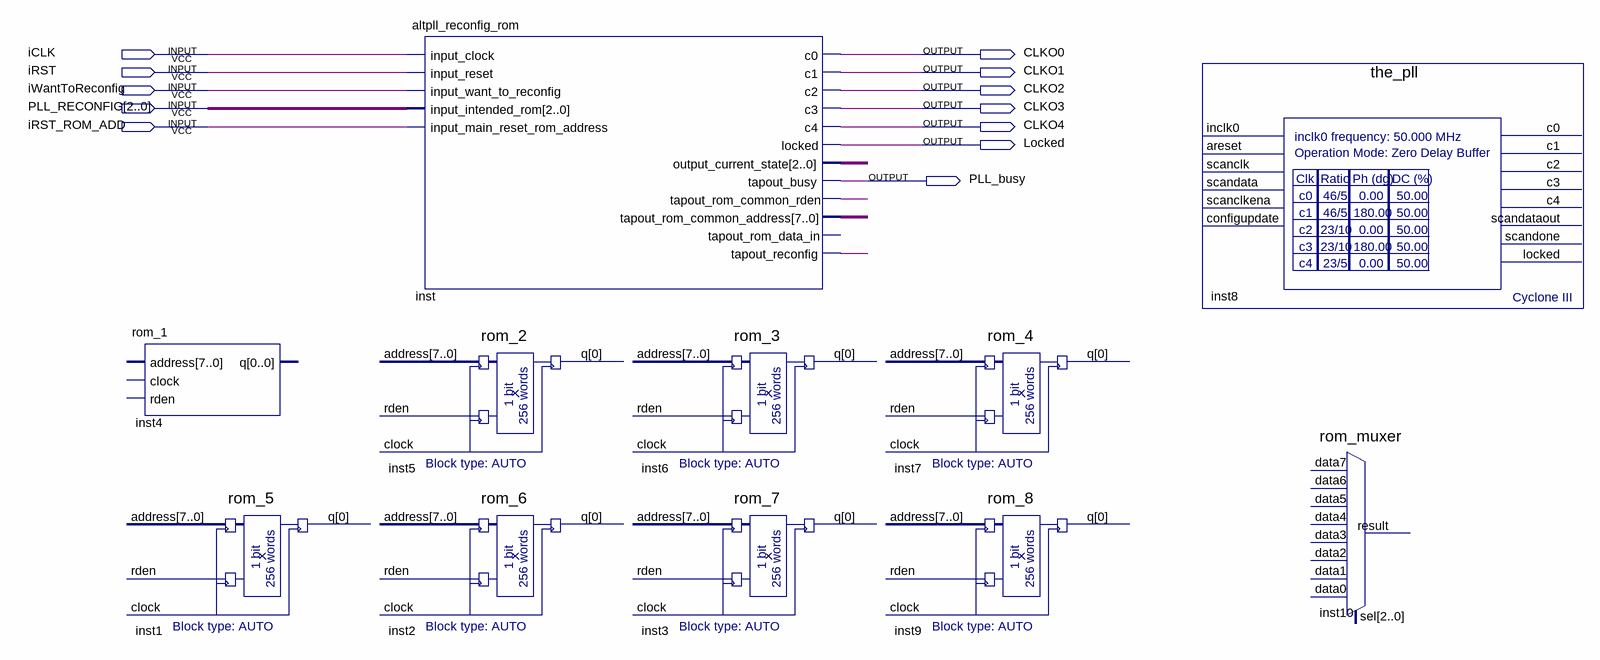
[diagram p0: schematic sheet]
// Quartus schematic PLL_Reconfig_TOP.bdf as structural Verilog: 11 symbols, 12 pins
module PLL_Reconfig_TOP (
  input  iCLK,
  input  iRST,
  input  iWantToReconfig,
  input  [2:0] PLL_RECONFIG,
  input  iRST_ROM_ADD,
  output CLKO0,
  output CLKO1,
  output CLKO2,
  output CLKO3,
  output CLKO4,
  output Locked,
  output PLL_busy
);

  wire inst_tapout_reconfig, inst_tapout_rom_common_rden;
  wire [2:0] inst_output_current_state;
  wire [7:0] inst_tapout_rom_common_address;

  rom_1 inst4 ();  // open: address, clock, rden, q
  rom_5 inst1 ();  // open: address, rden, clock, q
  rom_2 inst5 ();  // open: address, rden, clock, q
  rom_6 inst2 ();  // open: address, rden, clock, q
  altpll_reconfig_rom inst (
    .input_clock(iCLK), .input_reset(iRST), .input_want_to_reconfig(iWantToReconfig),
    .input_intended_rom(PLL_RECONFIG), .input_main_reset_rom_address(iRST_ROM_ADD), .c0(CLKO0), .c1(CLKO1),
    .c2(CLKO2), .c3(CLKO3), .c4(CLKO4), .locked(Locked), .output_current_state(inst_output_current_state),
    .tapout_busy(PLL_busy), .tapout_rom_common_rden(inst_tapout_rom_common_rden),
    .tapout_rom_common_address(inst_tapout_rom_common_address), .tapout_reconfig(inst_tapout_reconfig));  // open: tapout_rom_data_in
  rom_3 inst6 ();  // open: address, rden, clock, q
  rom_7 inst3 ();  // open: address, rden, clock, q
  rom_4 inst7 ();  // open: address, rden, clock, q
  rom_8 inst9 ();  // open: address, rden, clock, q
  the_pll inst8 ();  // open: inclk0, areset, scanclk, scandata, scanclkena, configupdate, c0, c1, c2, c3, c4, scandataout, scandone, locked
  rom_muxer inst10 ();  // open: data7, data6, data5, data4, data3, data2, data1, data0, sel, result
endmodule
